# EAGLE design amiga_4player_adapter (EAGLE 9.5.1)
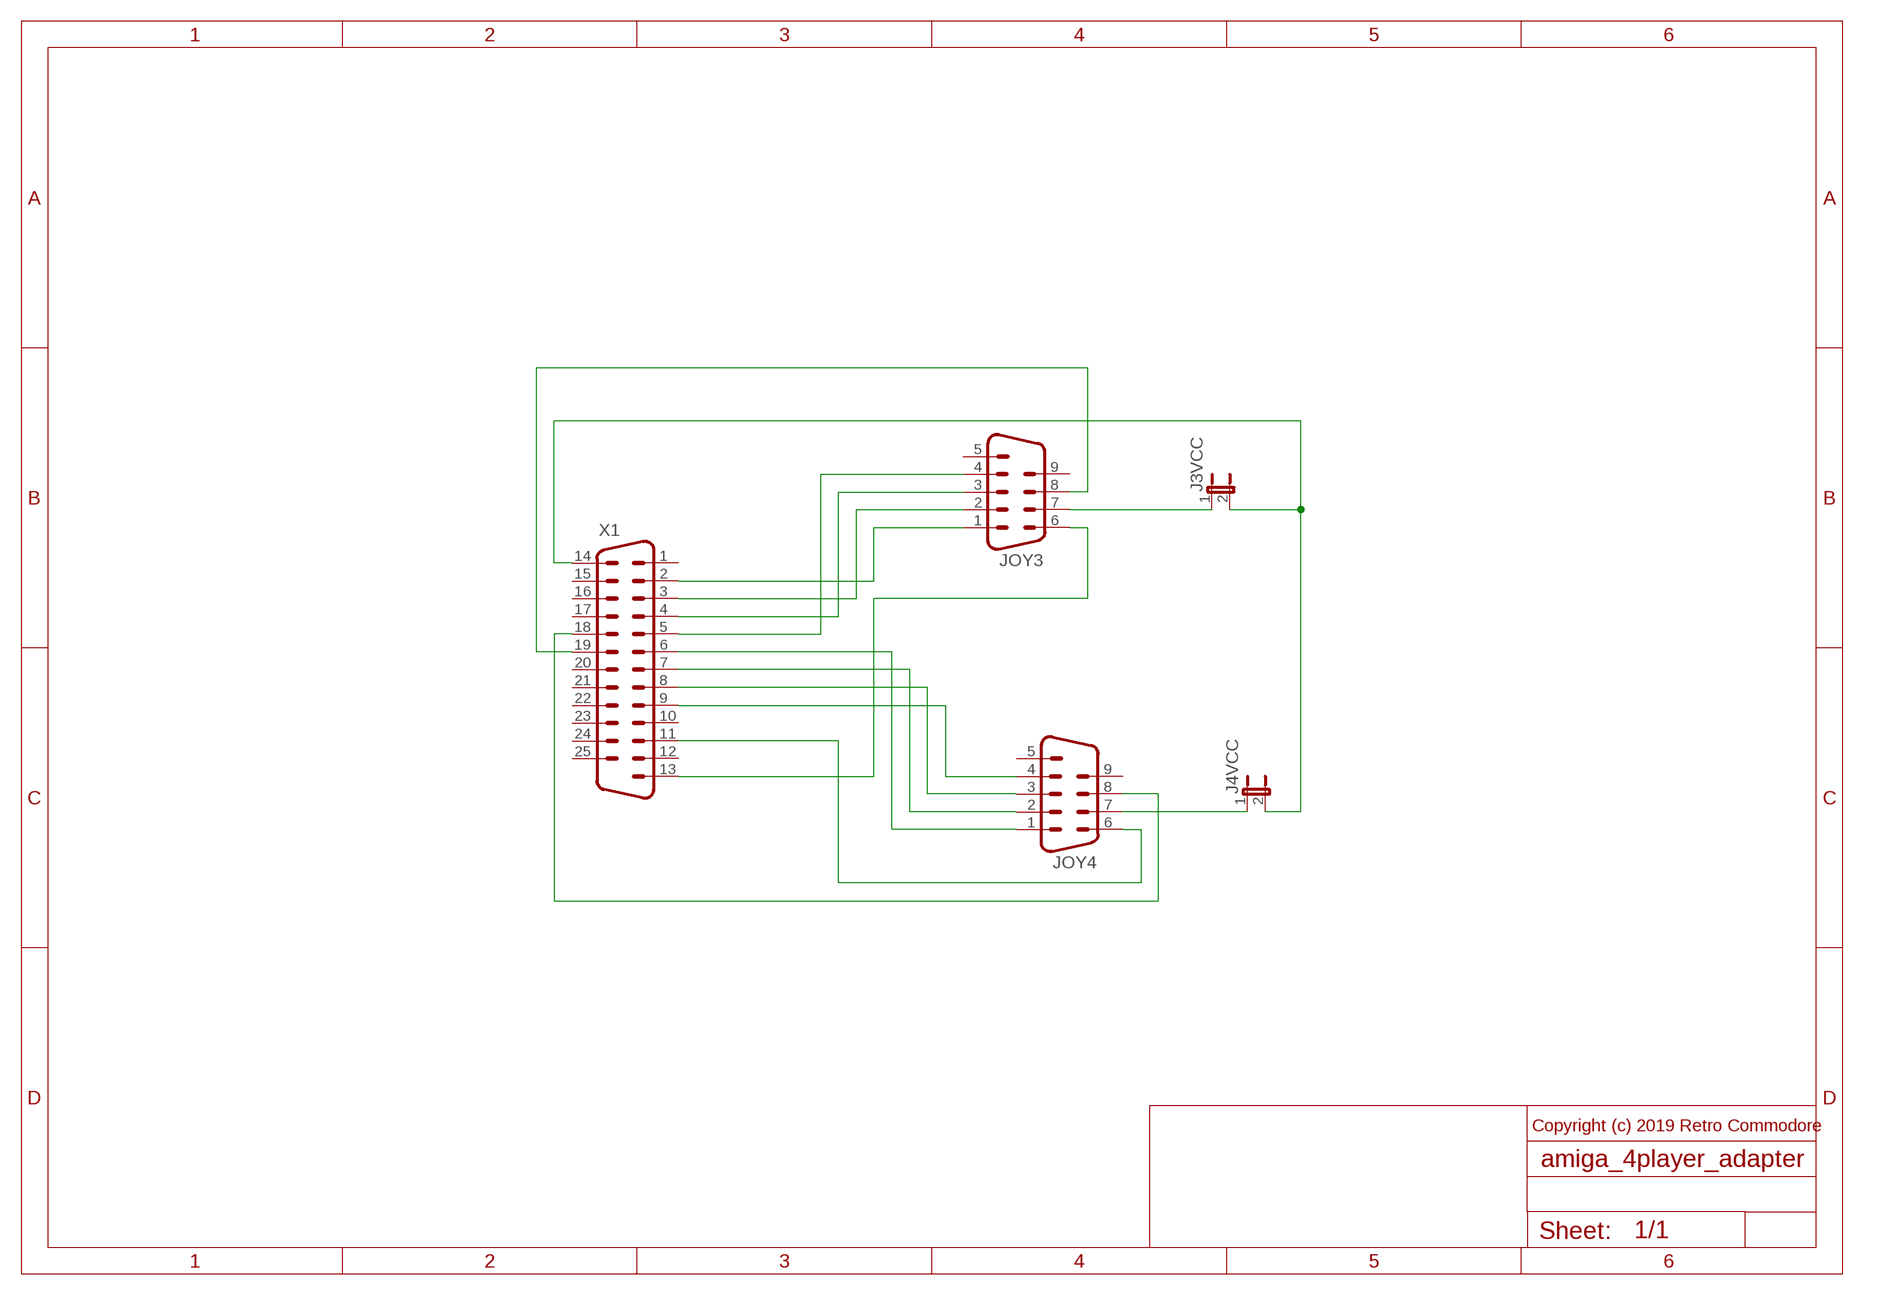
[diagram p0: schematic, sheet 1]

## Parts
J3VCC  JP1E  [JP1]
J4VCC  JP1E  [JP1]
JOY3  M09D  [M09D]
JOY4  M09D  [M09D]
X1  M25D  [M25D]

## Nets
GND: JOY3.8 JOY4.8 X1.18 X1.19
J3_DOWN: JOY3.2 X1.3
J3_FIRE: JOY3.6 X1.13
J3_LEFT: JOY3.3 X1.4
J3_RIGHT: JOY3.4 X1.5
J3_UP: JOY3.1 X1.2
J3_VCC: J3VCC.1 JOY3.7
J4_DOWN: JOY4.2 X1.7
J4_FIRE: JOY4.6 X1.11
J4_LEFT: JOY4.3 X1.8
J4_RIGHT: JOY4.4 X1.9
J4_UP: JOY4.1 X1.6
J4_VCC: J4VCC.1 JOY4.7
VCC: J3VCC.2 J4VCC.2 X1.14
Unconnected: JOY3.5 JOY3.9 JOY4.5 JOY4.9 X1.1 X1.10 X1.12 X1.15 X1.16 X1.17 X1.20 X1.21 X1.22 X1.23 X1.24 X1.25

## Notes on the sheet
- Copyright (c) 2019 Retro Commodore

## Library data of the parts
J3VCC J4VCC = jumper:JP1E: JUMPER
JOY3 JOY4 = con-subd:M09: SUB-D; OC_FARNELL: unknown; OC_NEWARK: unknown
X1 = con-subd:M25: SUB-D; OC_FARNELL: unknown; OC_NEWARK: unknown

## Board
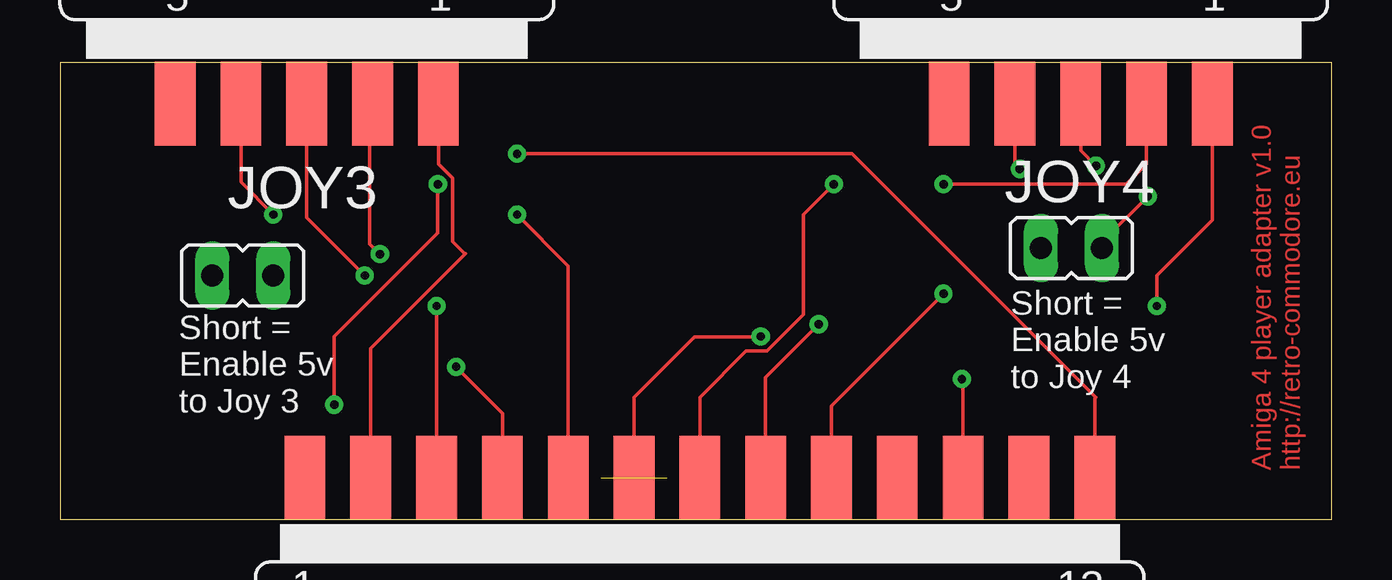
[diagram p1: board, top side]
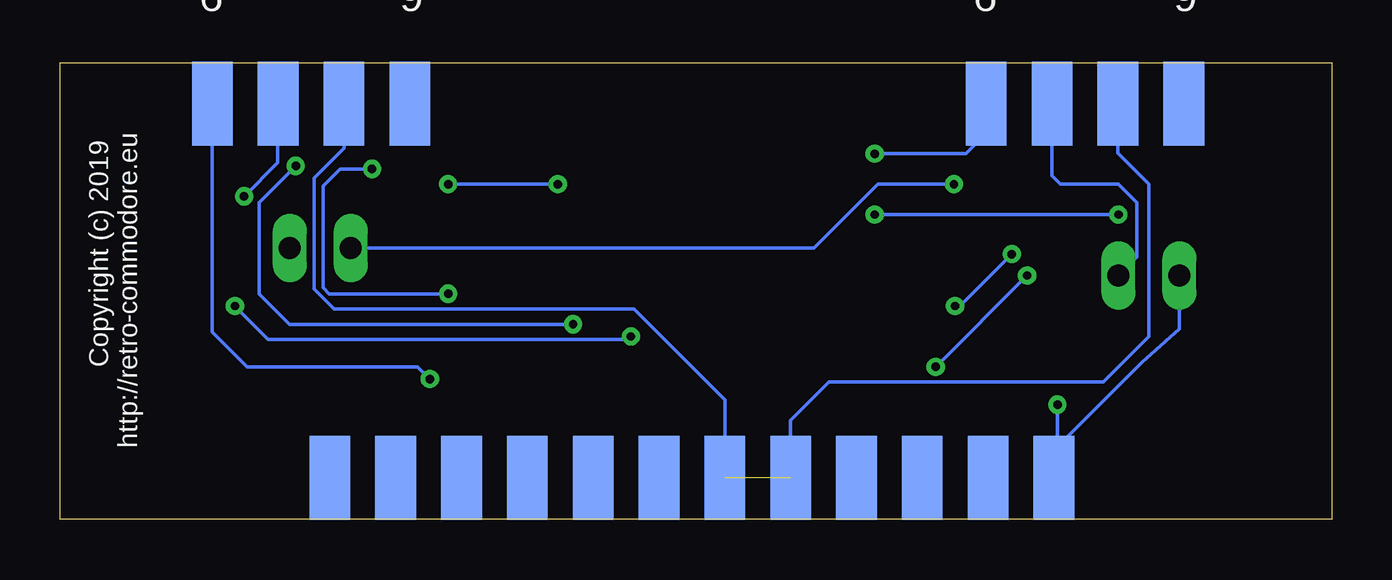
[diagram p2: board, bottom side, seen from below]

Size 53.01 x 19.04 mm. Coordinates in mm from the lower left corner, seen from the top.
Outline: 0,0 53.01,0 53.01,19.04 0,19.04 0,0
Copper layers (1*16): Top 0.035mm / dielectric 1.5mm / Bottom 0.035mm
Design rules "default": minimum track width 6mil, minimum drill 0.35mm, track to track 6mil, track to pad 6mil, pad to pad 6mil, via to via 6mil, smd to smd 6mil, copper to edge 40mil, drill to drill 6mil, minimum pad ring 10mil, minimum via ring 8mil, stop-mask expansion 4mil, vias tented up to drill 0mil, thermal gap 10mil

### Footprints (pad centres in the part's own frame; a part is rotated, then mirrored left to right if it is on the bottom)
JP1 = drill 0.914 long: 1 0,-1.27; 2 0,1.27
M09D = smd 1.7 x 3.5: 1 5.486,-6.045; 2 2.743,-6.045; 3 0,-6.045; 4 -2.743,-6.045; 5 -5.486,-6.045 | smd 1.7 x 3.5 bottom: 6 4.115,-6.045; 7 1.372,-6.045; 8 -1.372,-6.045; 9 -4.115,-6.045
M25D = smd 1.7 x 3.5: 1 16.459,-6.045; 2 13.716,-6.045; 3 10.973,-6.045; 4 8.23,-6.045; 5 5.486,-6.045; 6 2.743,-6.045; 7 0,-6.045; 8 -2.743,-6.045; 9 -5.486,-6.045; 10 -8.23,-6.045; 11 -10.973,-6.045; 12 -13.716,-6.045; 13 -16.459,-6.045 | smd 1.7 x 3.5 bottom: 14 15.088,-6.045; 15 12.344,-6.045; 16 9.601,-6.045; 17 6.858,-6.045; 18 4.115,-6.045; 19 1.372,-6.045; 20 -1.372,-6.045; 21 -4.115,-6.045; 22 -6.858,-6.045; 23 -9.601,-6.045; 24 -12.344,-6.045; 25 -15.088,-6.045

### Placement (x,y rotation side)
J3VCC  7.62,10.16 90 top
J4VCC  42.16,11.3 90 top
JOY3  10.29,23.37 0 top
JOY4  42.54,23.37 0 top
X1  26.67,-4.32 180 top

### Tracks (layer width: path | path; a pad name or v marks a point on that pad's centre or on a via)
GND  (1 unrouted)
  Bottom 0.152: X1.19 25.3,4.98 29.08,8.76 41.58,8.76 42.42,9.6 42.42,14.22 41.17,15.47 JOY4.8 | X1.18 22.55,4.12 20.96,5.71 9.53,5.71 7.62,7.62 7.62,13.97 8.91,15.27 JOY3.8 8.91,15.7
J3_DOWN  (via drill 0.35)
  Top 0.152: X1.3 v15.7,8.89 | v13.33,11.05 12.9,11.48 12.9,17.2 JOY3.2
  Bottom 0.152: v13.33,11.05 15.49,8.89 v15.7,8.89
J3_FIRE  (via drill 0.35)
  Top 0.152: X1.13 43.13,5.03 43.18,5.08 33.02,15.24 v19.05,15.24
  Bottom 0.152: v19.05,15.24 15.24,15.24 14.4,16.08 JOY3.6
J3_LEFT  (via drill 0.35)
  Top 0.152: v16.51,6.35 18.44,4.42 X1.4 | v12.7,10.16 10.29,12.57 JOY3.3
  Bottom 0.152: v12.7,10.16 v16.51,6.35
J3_RIGHT  (via drill 0.35)
  Top 0.152: X1.5 21.18,10.57 v19.05,12.7 | 7.62,17.25 JOY3.4 7.54,14.05 v8.89,12.7
  Bottom 0.152: v19.05,12.7 v8.89,12.7
J3_UP
  Top 0.152: X1.2 12.95,7.11 16.89,11.05 | 16.89,11.05 16.92,11.07 | JOY3.1 15.77,14.8 16.36,14.22 16.36,11.59 16.89,11.05
J3_VCC
  Bottom 0.152: 11.43,17.09 JOY3.7 11.66,14.33 11.3,13.97 8.89,13.97 8.13,13.21 8.13,10.92 J3VCC.1
J4_DOWN  (via drill 0.35)
  Top 0.152: X1.7 26.67,5.08 28.6,7.01 29.46,7.01 30.99,8.54 30.99,12.7 v32.26,13.97 | v36.83,13.97 44.45,13.97 45.29,14.81 JOY4.2
  Bottom 0.152: v32.26,13.97 v36.83,13.97
J4_FIRE  (via drill 0.35)
  Top 0.152: v37.59,5.84 37.64,5.79 X1.11
  Bottom 0.152: v37.59,5.84 38.1,6.35 45.21,6.35 46.66,7.8 JOY4.6
J4_LEFT  (via drill 0.35)
  Top 0.152: v31.62,8.13 29.41,5.92 X1.8 | v43.18,14.73 42.54,15.37 JOY4.3
  Bottom 0.152: v31.62,8.13 43.43,8.13 44.7,9.4 44.7,13.21 v43.18,14.73
J4_RIGHT  (via drill 0.35)
  Top 0.152: v36.83,9.4 32.16,4.72 X1.9 | v40,14.61 39.8,14.81 JOY4.4
  Bottom 0.152: v36.83,9.4 41.78,9.4 42.04,9.65 42.04,13.9 41.33,14.61 v40,14.61
J4_UP  (via drill 0.35)
  Top 0.152: X1.6 23.93,5.08 26.44,7.59 29.18,7.59 v29.21,7.62 | v45.72,8.89 45.72,10.16 48.03,12.47 JOY4.1
  Bottom 0.152: v29.21,7.62 29.34,7.49 44.32,7.49 v45.72,8.89
J4_VCC  (via drill 0.35)
  Top 0.152: v45.34,13.46 43.43,11.56 J4VCC.1
  Bottom 0.152: JOY4.7 43.94,17.3 43.94,14.86 v45.34,13.46
VCC  (via drill 0.35)
  Top 0.152: v11.43,4.77 11.43,7.62 15.75,11.94 v15.75,13.97
  Bottom 0.152: J3VCC.2 6.35,7.93 7.91,6.54 11.58,2.87 X1.14 11.43,1.88 v11.43,4.77 | v15.75,13.97 18.92,13.97 21.59,11.3 J4VCC.2

### Text on the board
Top: Amiga 4 player adapter v1.0 / http://retro-commodore.eu
tNames: Short = / Enable 5v / to Joy 4 | Short = / Enable 5v / to Joy 3
bNames: Copyright (c) 2019 / http://retro-commodore.eu